# Altium schematic sheet Sheet1.SchDoc
size A4
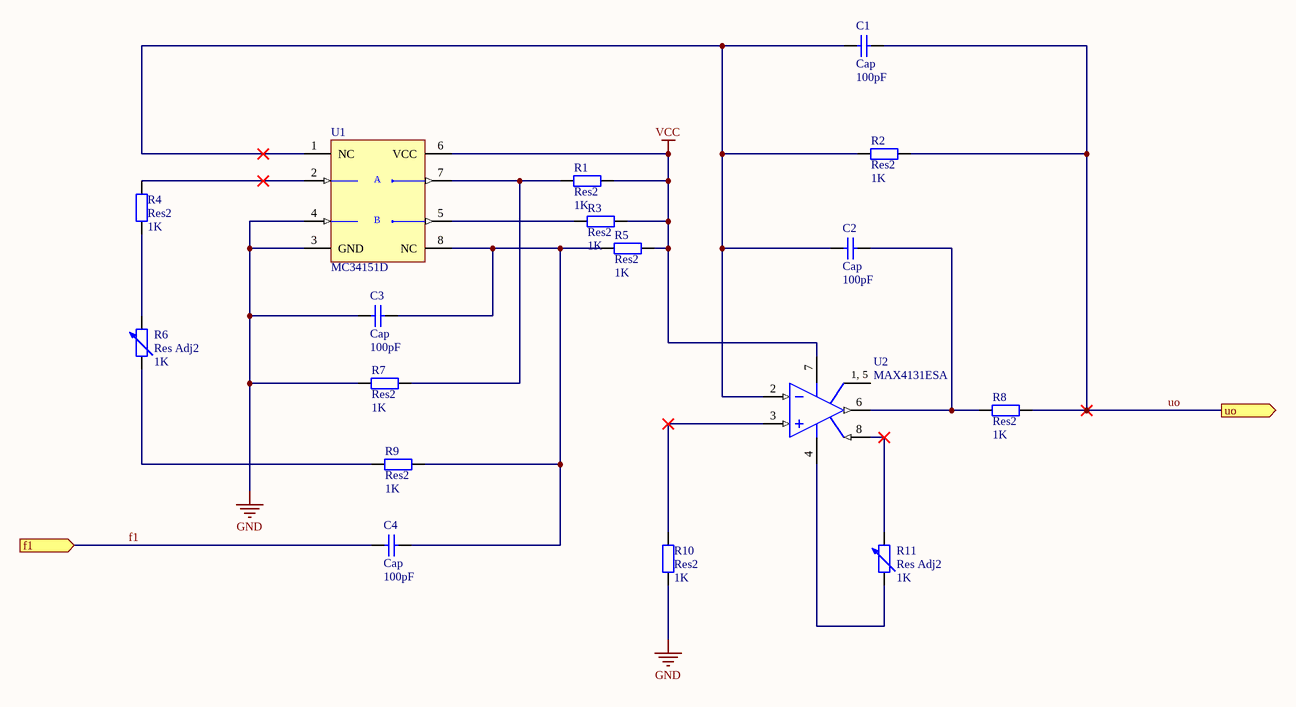
[diagram p0: Sheet1.SchDoc]

## Parts
C1  Cap  value 100pF  [RAD-0.3]
C2  Cap  value 100pF  [RAD-0.3]
C3  Cap  value 100pF  [RAD-0.3]
C4  Cap  value 100pF  [RAD-0.3]
R1  Res2  value 1K  [AXIAL-0.4]
R2  Res2  value 1K  [AXIAL-0.4]
R3  Res2  value 1K  [AXIAL-0.4]
R4  Res2  value 1K  [AXIAL-0.4]
R5  Res2  value 1K  [AXIAL-0.4]
R6  Res Adj2  value 1K  [AXIAL-0.6]
R7  Res2  value 1K  [AXIAL-0.4]
R8  Res2  value 1K  [AXIAL-0.4]
R9  Res2  value 1K  [AXIAL-0.4]
R10  Res2  value 1K  [AXIAL-0.4]
R11  Res Adj2  value 1K  [AXIAL-0.6]
U1  MC34151D  [751-06_N]
U2  MAX4131ESA  [NSO8_N]

## Ports
f1 (in), uo (out)

## Nets
GND: C3.1 R7.1 R10.2 U1.3(GND) U1.4(INB)
VCC: R1.2 R3.2 R5.2 U1.6(VCC) U2.7(VCC)
f1: C4.1 ; port f1
uo: C1.2 R2.1 R8.1 ; port uo
NetC1_1: C1.1 C2.1 R2.2 U1.1(NC) U2.2(IN-)
NetC2_2: C2.2 R8.2 U2.6(OUT)
NetC3_2: C3.2 C4.2 R5.1 R9.2 U1.8(NC)
NetR1_1: R1.1 R7.2 U1.7(~{OUTA})
NetR3_1: R3.1 U1.5(~{OUTB})
NetR4_1: R4.1 R6.2
NetR4_2: R4.2 U1.2(INA)
NetR6_1: R6.1 R9.1
NetR10_1: R10.1 U2.3(IN+)
NetR11_1: R11.1 U2.4(VEE)
NetR11_2: R11.2 U2.8(~{SHDN})
NetU2_1: U2.1(NC) U2.5(NC)

## Notes on the sheet
- (in symbol MAX4131ESA) 1, 5
- (in symbol MC34151D) A; B

## Library data of the parts
C1-C4 = Cap: Capacitor; Published: 8-Jun-2000; LatestRevisionDate: 17-Jul-2002; LatestRevisionNote: Re-released for DXP Platform.; PackageReference: RAD-0.3; Publisher: Altium Limited
R1-R5 R7-R10 = Res2: Resistor; Published: 8-Jun-2000; LatestRevisionDate: 17-Jul-2002; LatestRevisionNote: Re-released for DXP Platform.; PackageReference: AXIAL-0.4; Publisher: Altium Limited
R6 R11 = Res Adj2: Variable Resistor; Set Position: 0.5; Published: 8-Jun-2000; LatestRevisionDate: 17-Jul-2002; LatestRevisionNote: Re-released for DXP Platform.; PackageReference: AXIAL-0.6; Publisher: Altium Limited
U1 = MC34151D: High Speed Dual MOSFET Driver; Published: 17-Jul-2002; LatestRevisionDate: 13-Apr-2006; LatestRevisionNote: IPC-7351 Footprint Added.; DatasheetVersion: Apr-2000; PackageVersion: Sep-1999; PackageReference: 751-06; Publisher: Altium Limited; PackageDescription: 8-Pin Small Outline Integrated Circuit 1.27 mm Pitch; Code_JEDEC: MS-012-AA; Code_IPC: SOIC127P600-8; ComponentLink1Description: Manufacturer Link; ComponentLink1URL: http://www.onsemi.com/site/products/parametrics/0,4446,388,00.html; ComponentLink2Description: Datasheet; ComponentLink2URL: http://www.onsemi.com/pub/Collateral/MC34151-D.PDF
U2 = MAX4131ESA: Wide-Bandwidth, Low-Power, Single-Supply Rail-to-Rail I/O Op Amp; Published: 23-Sep-2002; LatestRevisionDate: 13-Apr-2006; LatestRevisionNote: IPC-7351 Footprint Added.; DatasheetVersion: Rev 2; 8/97; PackageReference: NSO8; Publisher: Altium Limited; PackageDescription: 8-Pin Small Outline Integrated Circuit 1.27 mm Pitch; Code_JEDEC: MS-012-AA; Code_IPC: SOIC127P600-8; ComponentLink1Description: Manufacturer Link; ComponentLink1URL: http://www.maxim-ic.com/; ComponentLink2Description: Datasheet; ComponentLink2URL: http://pdfserv.maxim-ic.com/en/ds/MAX4130-MAX4134.pdf